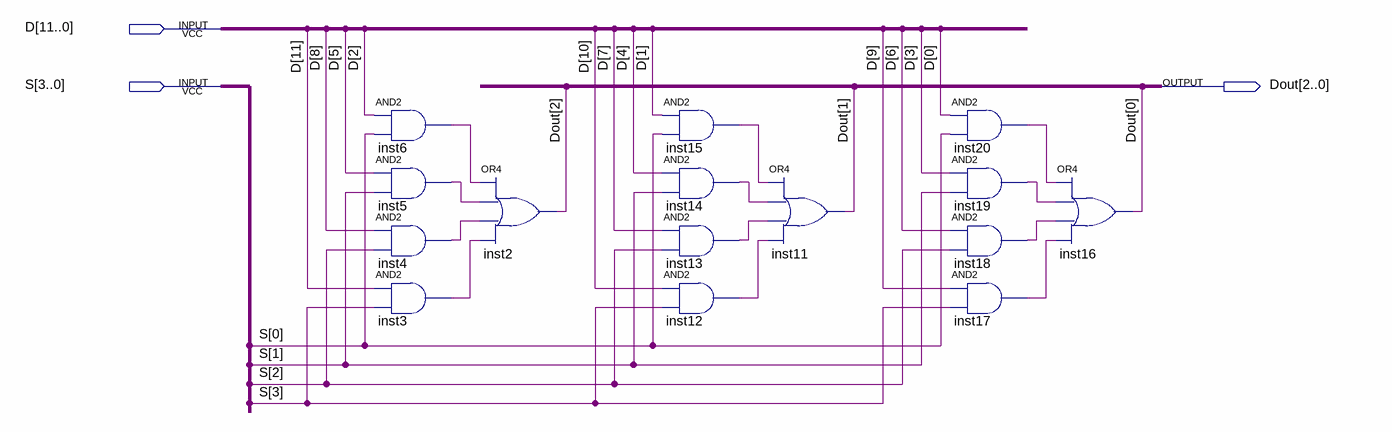
[diagram p0: schematic sheet]
// Quartus schematic Output4x3.bdf as structural Verilog: 15 symbols, 3 pins
module Output4x3 (
  input  [11:0] D,
  input  [3:0] S,
  output [2:0] Dout
);

  wire inst3_out, inst4_out, inst5_out, inst6_out, inst12_out, inst13_out, inst14_out, inst15_out,
       inst17_out, inst18_out, inst19_out, inst20_out;

  and inst6 (inst6_out, D[2], S[0]);
  and inst5 (inst5_out, D[5], S[1]);
  and inst4 (inst4_out, D[8], S[2]);
  and inst3 (inst3_out, D[11], S[3]);
  or inst2 (Dout[2], inst6_out, inst5_out, inst4_out, inst3_out);
  and inst15 (inst15_out, D[1], S[0]);
  and inst14 (inst14_out, D[4], S[1]);
  and inst13 (inst13_out, D[7], S[2]);
  and inst12 (inst12_out, D[10], S[3]);
  or inst11 (Dout[1], inst15_out, inst14_out, inst13_out, inst12_out);
  and inst20 (inst20_out, D[0], S[0]);
  and inst19 (inst19_out, D[3], S[1]);
  and inst18 (inst18_out, D[6], S[2]);
  and inst17 (inst17_out, D[9], S[3]);
  or inst16 (Dout[0], inst20_out, inst19_out, inst18_out, inst17_out);
endmodule
